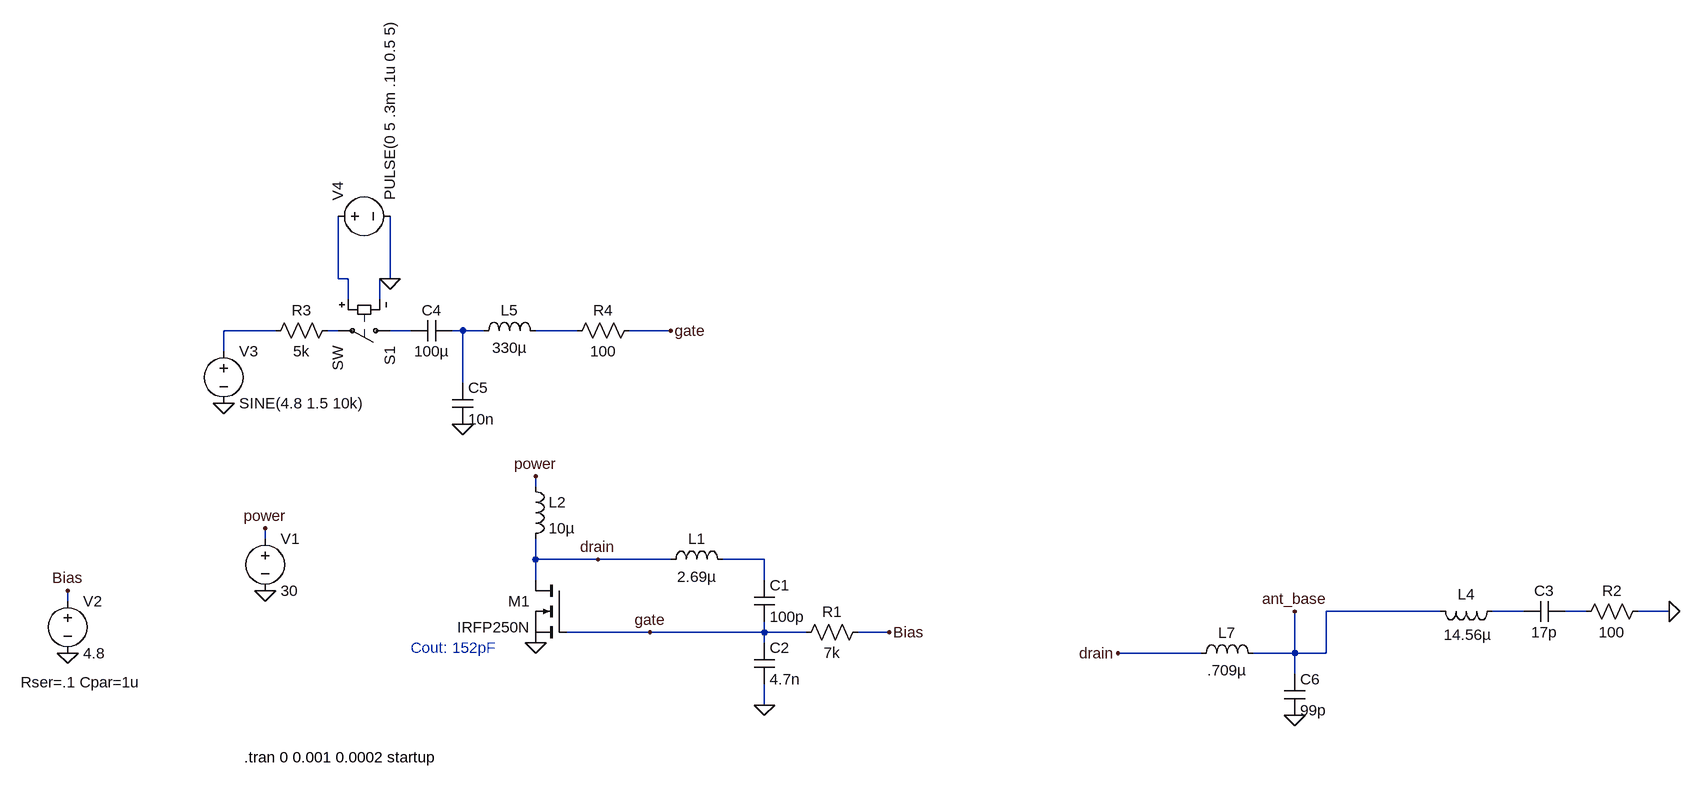
[diagram p0: schematic AMhz10-radio-gate_modulation.asc]
AMhz10-radio-gate_modulation.asc, the LTspice schematic file:
Version 4
SHEET 1 2004 680
WIRE -64 -416 -64 -512
WIRE -48 -416 -64 -416
WIRE 16 -416 16 -512
WIRE 16 -416 0 -416
WIRE -48 -384 -48 -416
WIRE 0 -384 0 -416
WIRE -160 -336 -240 -336
WIRE -64 -336 -80 -336
WIRE 48 -336 16 -336
WIRE 128 -336 112 -336
WIRE 160 -336 128 -336
WIRE 304 -336 240 -336
WIRE 448 -336 384 -336
WIRE -240 -304 -240 -336
WIRE 128 -256 128 -336
WIRE 240 -96 240 -112
WIRE -176 -16 -176 -32
WIRE 240 16 240 -16
WIRE 336 16 240 16
WIRE 448 16 336 16
WIRE 592 16 528 16
WIRE 240 48 240 16
WIRE 592 48 592 16
WIRE -480 80 -480 64
WIRE 1632 96 1456 96
WIRE 1760 96 1712 96
WIRE 1856 96 1824 96
WIRE 1984 96 1936 96
WIRE 416 128 288 128
WIRE 592 128 592 112
WIRE 592 128 416 128
WIRE 656 128 592 128
WIRE 784 128 736 128
WIRE 592 144 592 128
WIRE 1264 160 1136 160
WIRE 1408 160 1408 96
WIRE 1408 160 1344 160
WIRE 1456 160 1456 96
WIRE 1456 160 1408 160
WIRE 1408 192 1408 160
WIRE 592 240 592 208
FLAG -176 -32 power
FLAG 240 -112 power
FLAG 240 144 0
FLAG 592 240 0
FLAG -176 64 0
FLAG -480 64 Bias
FLAG -480 160 0
FLAG 784 128 Bias
FLAG 1984 96 0
FLAG 416 128 gate
FLAG 448 -336 gate
FLAG -240 -224 0
FLAG 128 -192 0
FLAG 1408 96 ant_base
FLAG 1408 256 0
FLAG 336 16 drain
FLAG 1136 160 drain
FLAG 16 -416 0
SYMBOL nmos 288 48 M0
SYMATTR InstName M1
SYMATTR Value IRFP250N
SYMBOL ind 432 32 R270
WINDOW 0 32 56 VTop 2
WINDOW 3 5 56 VBottom 2
SYMATTR InstName L1
SYMATTR Value 2.69µ
SYMBOL cap 576 48 R0
SYMATTR InstName C1
SYMATTR Value 100p
SYMATTR SpiceLine Rser=.01
SYMBOL voltage -176 -32 R0
WINDOW 123 0 0 Left 0
WINDOW 39 0 0 Left 0
SYMATTR InstName V1
SYMATTR Value 30
SYMBOL voltage -480 64 R0
WINDOW 123 0 0 Left 0
WINDOW 39 -72 141 Left 2
SYMATTR SpiceLine Rser=.1 Cpar=1u
SYMATTR InstName V2
SYMATTR Value 4.8
SYMBOL cap 576 144 R0
SYMATTR InstName C2
SYMATTR Value 4.7n
SYMATTR SpiceLine Rser=.01
SYMBOL ind 224 -112 R0
SYMATTR InstName L2
SYMATTR Value 10µ
SYMBOL res 752 112 R90
WINDOW 0 0 56 VBottom 2
WINDOW 3 32 56 VTop 2
SYMATTR InstName R1
SYMATTR Value 7k
SYMBOL cap 1824 80 R90
WINDOW 0 0 32 VBottom 2
WINDOW 3 32 32 VTop 2
SYMATTR InstName C3
SYMATTR Value 17p
SYMBOL res 1840 112 R270
WINDOW 0 32 56 VTop 2
WINDOW 3 0 56 VBottom 2
SYMATTR InstName R2
SYMATTR Value 100
SYMBOL ind 1728 80 R90
WINDOW 0 5 56 VBottom 2
WINDOW 3 36 54 VTop 2
SYMATTR InstName L4
SYMATTR Value 14.56µ
SYMBOL cap 112 -352 R90
WINDOW 0 0 32 VBottom 2
WINDOW 3 32 32 VTop 2
SYMATTR InstName C4
SYMATTR Value 100µ
SYMBOL ind 144 -320 R270
WINDOW 0 32 56 VTop 2
WINDOW 3 5 56 VBottom 2
SYMATTR InstName L5
SYMATTR Value 330µ
SYMATTR SpiceLine Rser=100
SYMBOL res -64 -352 R90
WINDOW 0 0 56 VBottom 2
WINDOW 3 32 56 VTop 2
SYMATTR InstName R3
SYMATTR Value 5k
SYMBOL voltage -240 -320 R0
WINDOW 123 0 0 Left 0
WINDOW 39 0 0 Left 0
SYMATTR InstName V3
SYMATTR Value SINE(4.8 1.5 10k)
SYMBOL cap 112 -256 R0
SYMATTR InstName C5
SYMATTR Value 10n
SYMBOL sw 32 -336 R90
SYMATTR InstName S1
SYMBOL voltage -80 -512 R270
WINDOW 123 0 0 Left 0
WINDOW 39 0 0 Left 0
SYMATTR InstName V4
SYMATTR Value PULSE(0 5 .3m .1u 0.5 5)
SYMBOL cap 1392 192 R0
SYMATTR InstName C6
SYMATTR Value 99p
SYMATTR SpiceLine Rser=.01
SYMBOL ind 1248 176 R270
WINDOW 0 32 56 VTop 2
WINDOW 3 5 56 VBottom 2
SYMATTR InstName L7
SYMATTR Value .709µ
SYMBOL res 400 -352 R90
WINDOW 0 0 56 VBottom 2
WINDOW 3 32 56 VTop 2
SYMATTR InstName R4
SYMATTR Value 100
TEXT -208 320 Left 2 !.tran 0 0.001 0.0002 startup
TEXT 48 152 Left 2 ;Cout: 152pF

The netlist it stands for:
* AMhz10-radio-gate_modulation.asc
M1 drain gate 0 0 IRFP250N
L1 drain N007 2.69µ
C1 N007 gate 100p Rser=.01
V1 power 0 30
V2 Bias 0 4.8 Rser=.1 Cpar=1u
C2 gate 0 4.7n Rser=.01
L2 power drain 10µ
R1 Bias gate 7k
C3 N009 N008 17p
R2 N009 0 100
L4 N008 ant_base 14.56µ
C4 N005 N004 100µ
L5 N005 N006 330µ Rser=100
R3 N003 N002 5k
V3 N002 0 SINE(4.8 1.5 10k)
C5 N005 0 10n
S1 N004 N003 N001 0 SW
V4 N001 0 PULSE(0 5 .3m .1u 0.5 5)
C6 ant_base 0 99p Rser=.01
L7 drain ant_base .709µ
R4 gate N006 100
.model NMOS NMOS
.model PMOS PMOS
.lib standard.mos
.tran 0 0.001 0.0002 startup
* Cout: 152pF
.backanno
.end